# EasyEDA schematic SCH_Group-50_Final_2026-01-02.json
TITLE: Sheet_1; REV: 1.0; Date: 2025-05-09; Sheet: 1/1; Drawn By: b24269; Company: Your Company
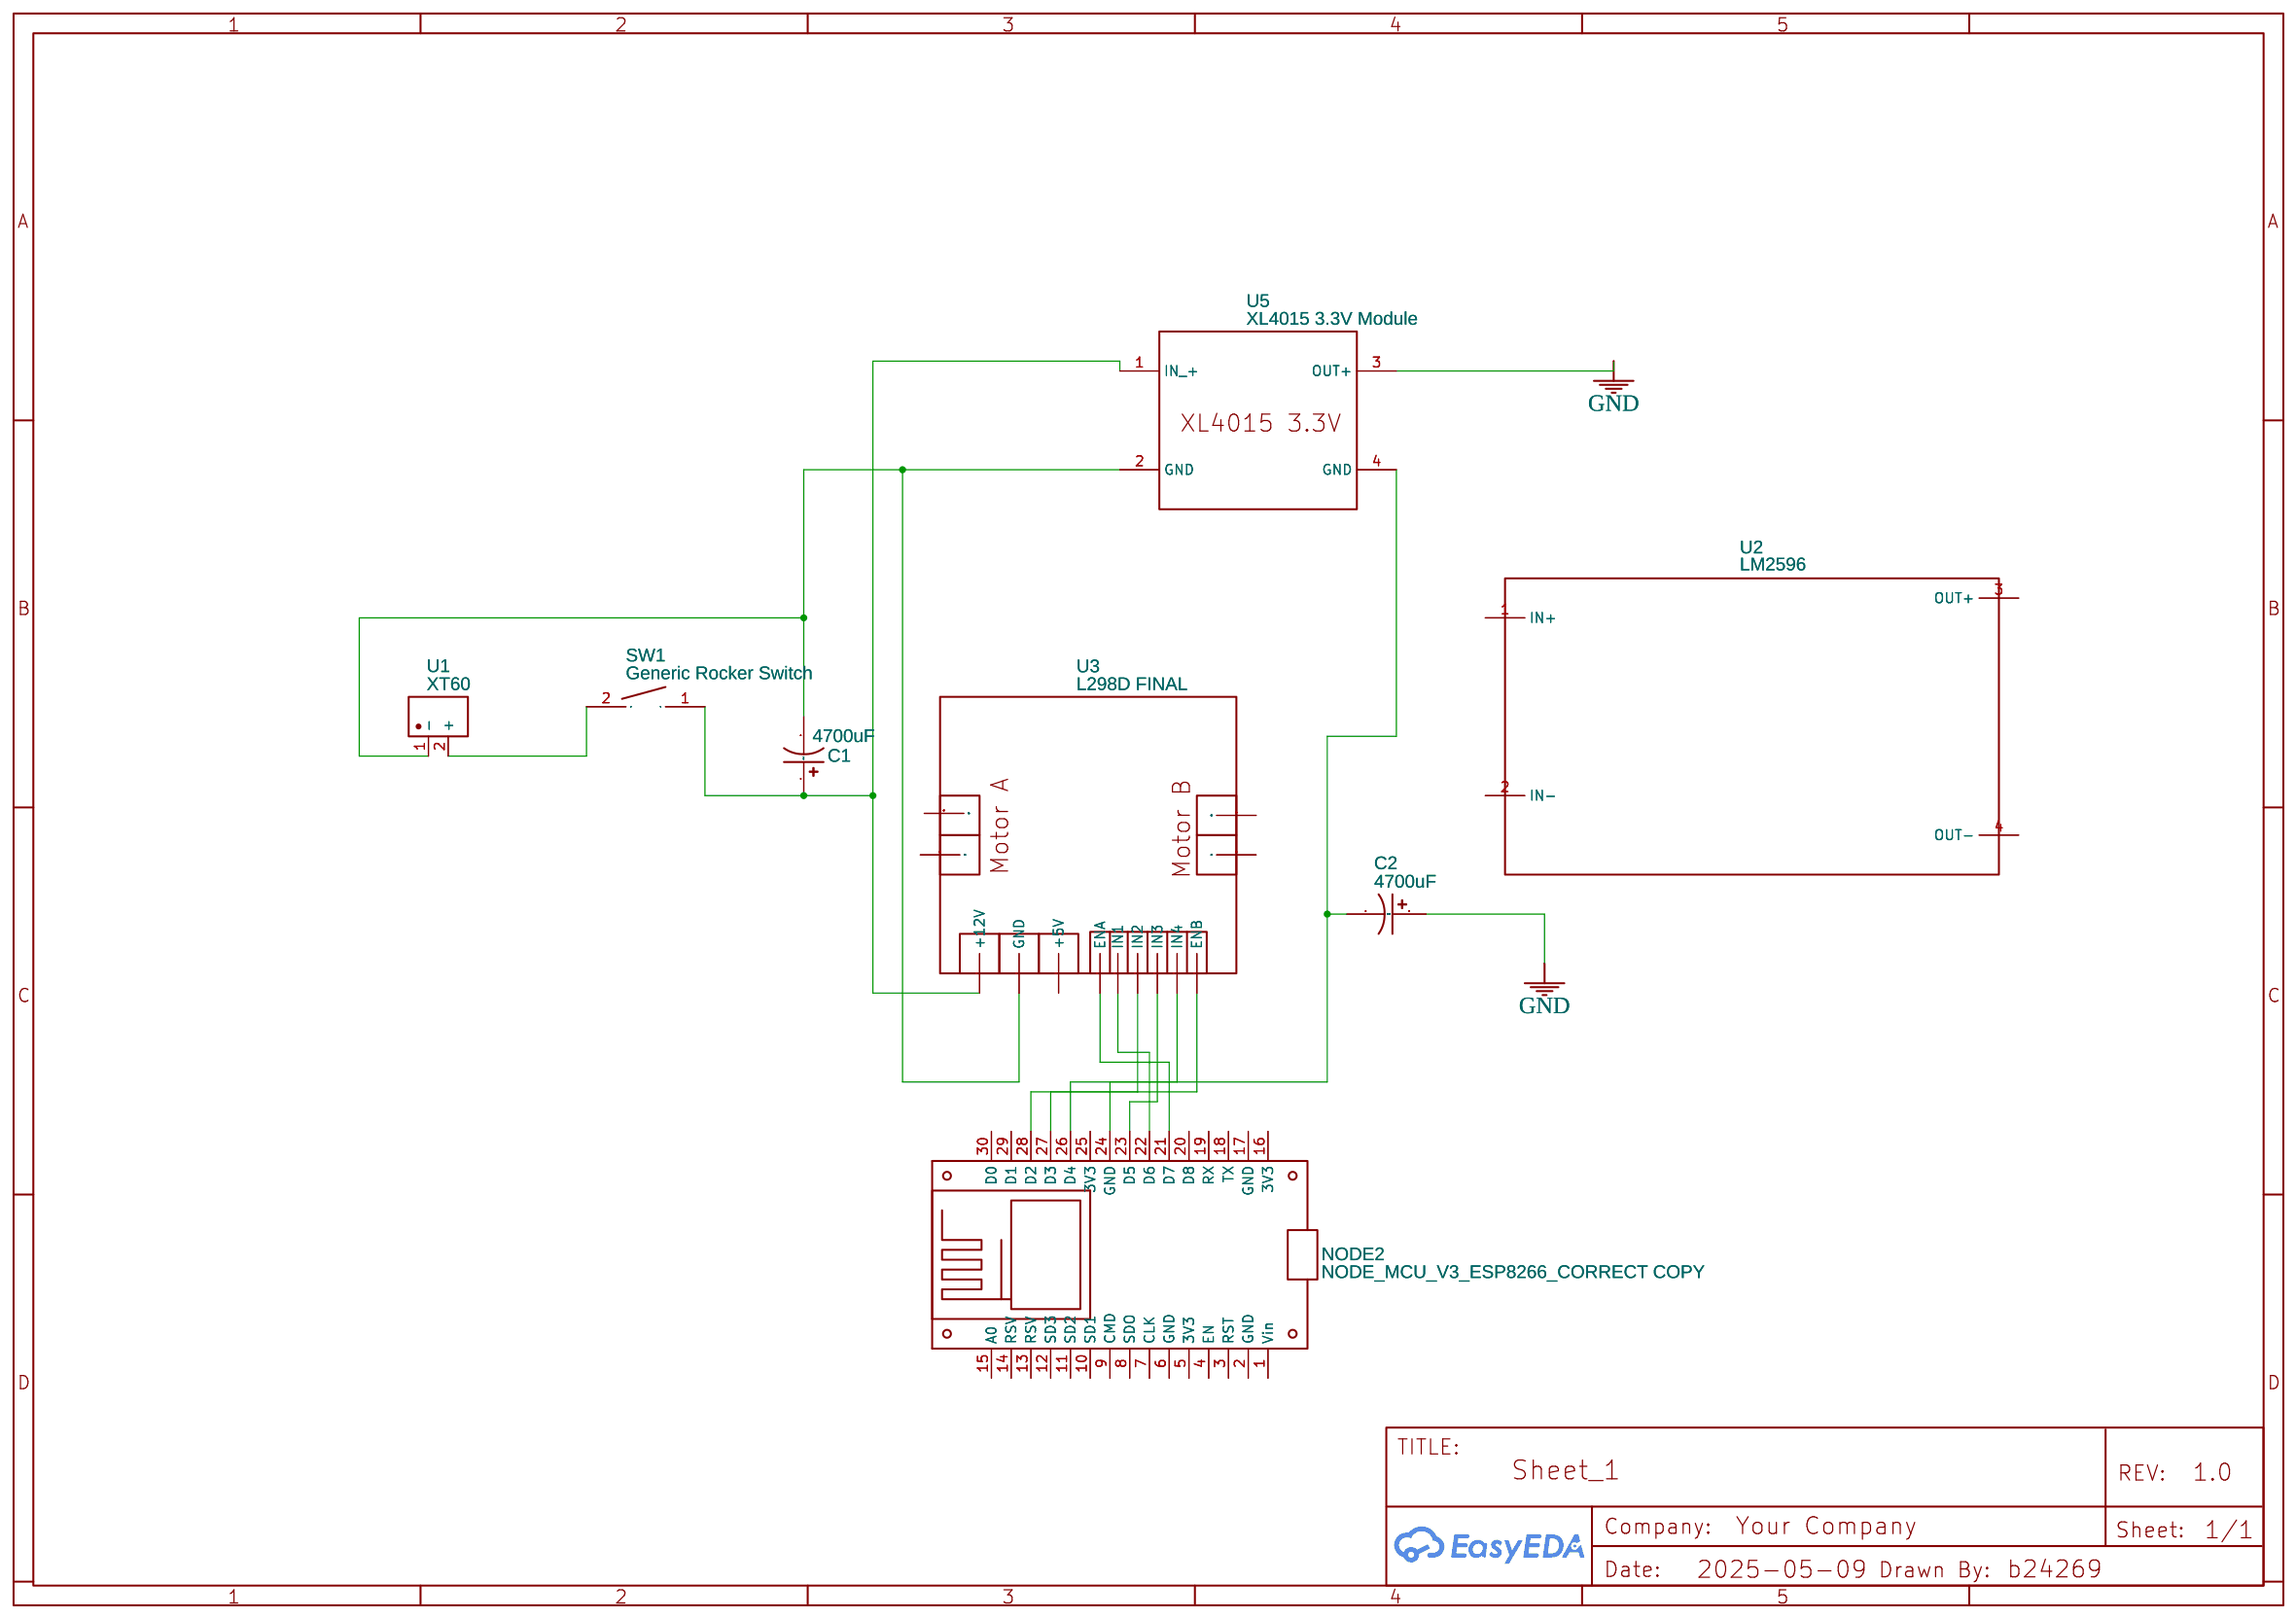
[diagram p0: schematic sheet]

## Parts
C1  4700uF  [4700UF 25V 16X25]
C2  4700uF  [4700UF 25V 16X25]
NODE2  NODE_MCU_V3_ESP8266_CORRECT COPY  [NODEMCU-12E;NODEMCU-ESP8266]
SW1  Generic Rocker Switch  [2 PIN ROCKER SWITCH]
U1  XT60  [CONN-TH_XT60]
U2  LM2596  [NEW_FOOTPRINT]
U3  L298D FINAL  [L298D - MODULE]
U5  XL4015 3.3V Module  [XL4015MODULE]

## Library data of the parts
C1 C2 = 4700UF 25V 16X25: Contributor: lcsc; Supplier: LCSC
NODE2 = NODE_MCU_V3_ESP8266_CORRECT COPY: Contributor: geogeporcel; Supplier: TME
SW1 = Generic Rocker Switch: Supplier: LCSC; Supplier Part: C273445; Manufacturer: E-Switch; Manufacturer Part: R1966FBLKWHTEF; Contributor: Thành Hoàng
U1 = XT60: Contributor: lcsc; Supplier: LCSC; Supplier Part: C98733; Manufacturer: AMASS(艾迈斯); JLCPCB Part Class: Extended Part
U2 = LM2596: Contributor: 36dheerajbalodi
U3 = L298D FINAL: Contributor: jyotirmoy
U5 = XL4015 3.3V Module: Contributor: vikmaster.ua

## Nets
GND: C2.1 U5.3(OUT+)
Net-(C1-1): C1.1 SW1.1 U3.+12V U5.1(IN +)
Net-(C1-2): C1.2 U1.1(-) U3.GND U5.2(GND)
Net-(C2-2): C2.2 NODE2.24(GND) U5.4(GND)
Net-(NODE2-21): NODE2.21(D7) U3.ENA
Net-(NODE2-22): NODE2.22(D6) U3.IN1
Net-(NODE2-23): NODE2.23(D5) U3.IN3
Net-(NODE2-26): NODE2.26(D4) U3.IN4
Net-(NODE2-27): NODE2.27(D3) U3.ENB
Net-(NODE2-28): NODE2.28(D2) U3.IN2
Net-(SW1-2): SW1.2 U1.2(+)

Not connected (* = marked no-connect by the designer): NODE2 1(Vin) 2(GND) 3(RST) 4(EN) 5(3V3) 6(GND) 7(CLK) 8(SDO) 9(CMD) 10(SD1) 11(SD2) 12(SD3) 13(RSV) 14(RSV) 15(A0) 16(3V3) 17(GND) 18(TX) 19(RX) 20(D8) 25(3V3) 29(D1) 30(D0); U2 1(IN+) 2(IN-) 3(OUT+) 4(OUT-); U3 +5V OUT1 OUT2 OUT3 OUT4
